# EAGLE design d11toy3 (EAGLE 6.6.0)
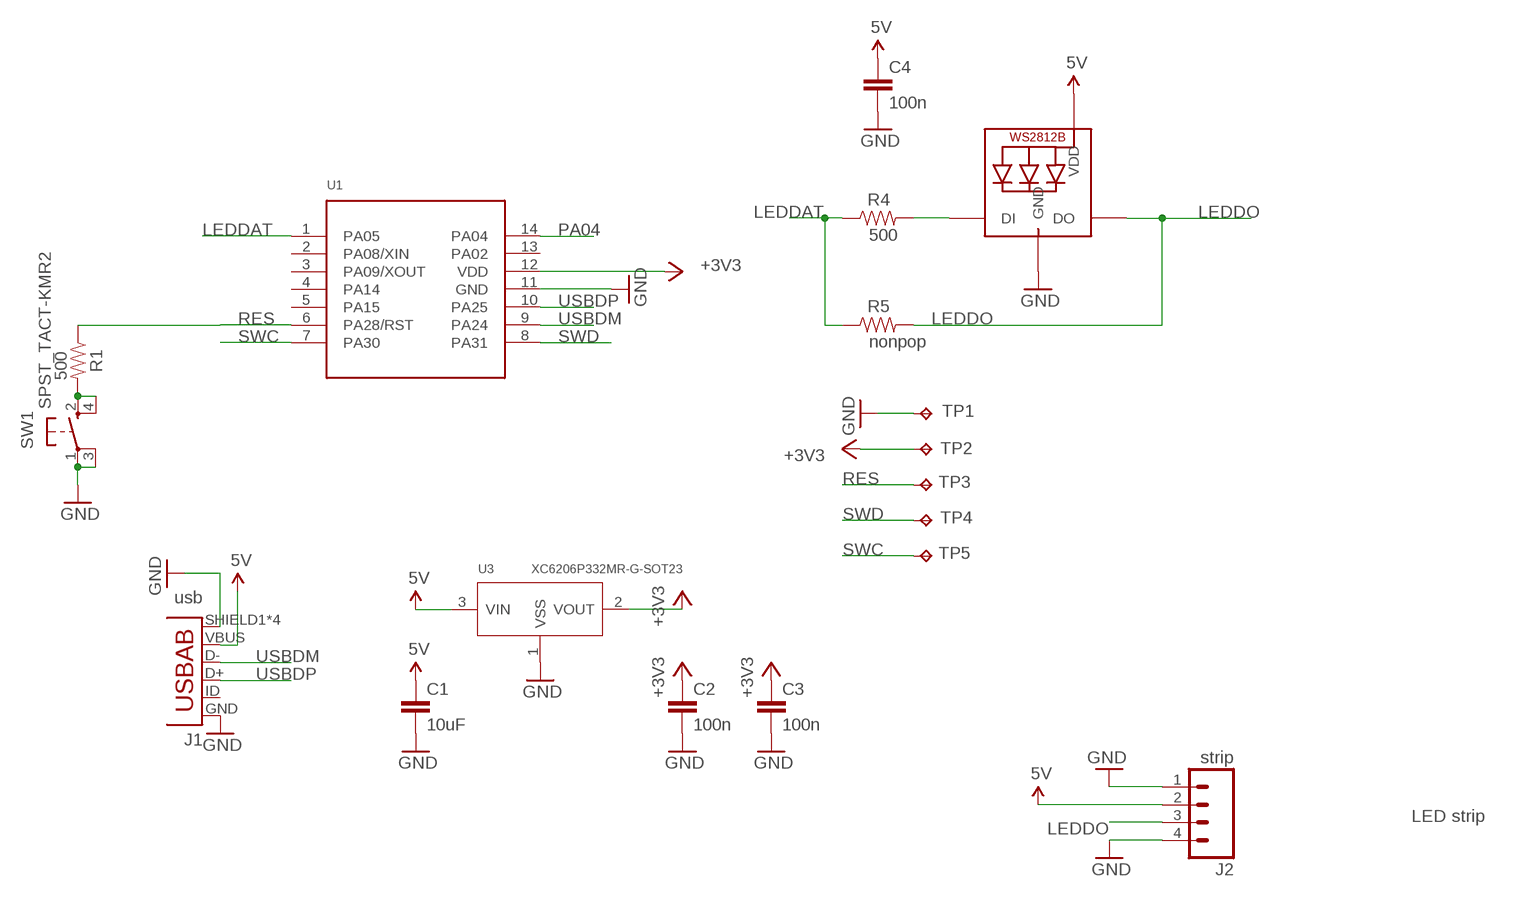
[diagram p0: schematic, sheet 1]

## Parts
C1  10uF  CAP0603-CAP  [0603-CAP]
C2  100n  CAP0603-CAP  [0603-CAP]
C3  100n  CAP0603-CAP  [0603-CAP]
C4  100n  CAP0603-CAP  [0603-CAP]
J1  usb  USB-AB  [USB-AB-MICRO-SMD]
J2  strip  M04NO_SILK_ALL_ROUND  [1X04_NO_SILK_ALL_ROUND]
LED2  WS2812B5050  [WS2812B]
R1  500  RESISTOR0603-RES  [0603-RES]
R4  500  RESISTOR0603-RES  [0603-RES]
R5  nonpop  RESISTOR0603-RES  [0603-RES]
SW1  SPST_TACT-KMR2  [KMR2]
TP1  TPB1,27  [B1,27]
TP2  TPB1,27  [B1,27]
TP3  TPB1,27  [B1,27]
TP4  TPB1,27  [B1,27]
TP5  TPB1,27  [B1,27]
U1  SAMD11C14  [SO14]
U3  XC6206P332MR-G-SOT23  PMIC-LDO-XC6206P332MR-G(SOT23)  [SOT-23]

## Nets
5V: C1.1 C4.1 J1.VBUS J2.2 LED2.1-VDD(VDD) U3.3(VIN)
+3V3: C2.1 C3.1 TP2.TP U1.12(VDD) U3.2(VOUT)
GND: C1.2 C2.2 C3.2 C4.2 J1.GND J1.SHIELD1(SHIELD) J1.SHIELD2(SHIELD) J1.SHIELD3(SHIELD) J1.SHIELD4(SHIELD) J2.1 J2.4 LED2.3-GND(GND) SW1.1(P) SW1.3(P1) TP1.TP U1.11(GND) U3.1(VSS)
LEDDAT: R4.1 R5.1 U1.1(PA05)
LEDDO: J2.3 LED2.2-DOUT(DO) R5.2
N$2: R1.2 SW1.2(S) SW1.4(S1)
N$5: LED2.4-DIN(DI) R4.2
PA04: U1.14(PA04)
RES: R1.1 TP3.TP U1.6(PA28/RST)
SWC: TP5.TP U1.7(PA30)
SWD: TP4.TP U1.8(PA31)
USBDM: J1.D- U1.9(PA24)
USBDP: J1.D+ U1.10(PA25)
Unconnected: J1.ID(USBID) U1.2(PA08/XIN) U1.3(PA09/XOUT) U1.4(PA14) U1.5(PA15) U1.13(PA02)

## Notes on the sheet
- LED strip

## Library data of the parts
C1-C4 = SparkFun-Capacitors:CAP: Capacitor Standard 0603 ceramic capacitor, and 0.1" leaded capacitor.
J1 = SparkFun-Connectors:USB-AB: This is a USB AB connector that is compatible with USB OTG. i.e. this connector can serve as a host or device
J2 = SparkFun-Connectors:M04: Header 4 Standard 4-pin 0.1" header. Use with straight break away headers (SKU : PRT-00116), right angle break away headers (PRT-00553), swiss pins (PRT-00743), machine pins (PRT-00117), and female headers (PRT-00115). Molex polarized connector foot print use with SKU : PRT-08231 with associated crimp pins and housings. 1MM SMD Version SKU: PRT-10208; PROD_ID: CONN-09696
LED2 = adafruit:WS2812B
R1 R4 R5 = SparkFun-Passives:RESISTOR: Resistor Basic schematic elements and footprints for 0603, 1206, and PTH resistors.
SW1 = adafruit:SPST_TACT: SMT 6mm switch, EVQQ2 series http://www.ladyada.net/library/eagle
TP1-TP5 = testpad:TP: Test pad
U1 = todstuff:SAMD11C14: ATSAMD11C14A-SS - SAMD11 14-pin SOIC
U3 = Seeed-IC-2016:PMIC-LDO-XC6206P332MR-G(SOT23): 310030099; MPN: XC6206P332MR-G

## Board
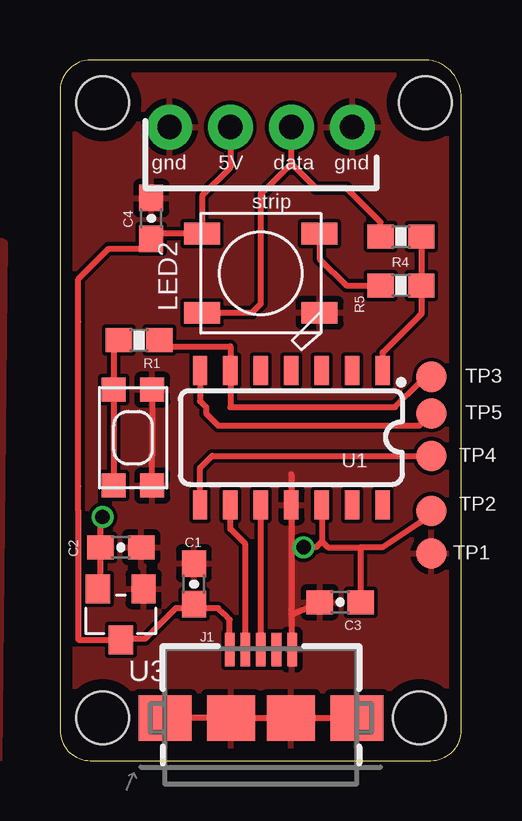
[diagram p1: board, top side]
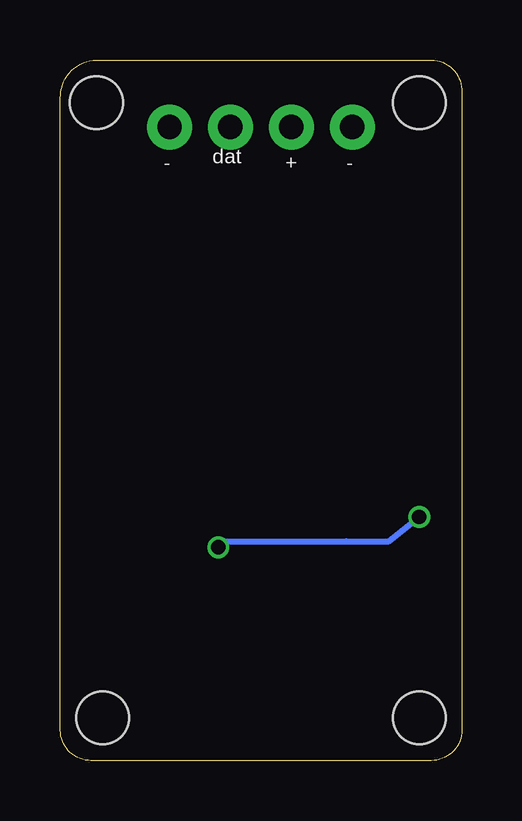
[diagram p2: board, bottom side, seen from below]

Size 16.74 x 29.21 mm. Coordinates in mm from the lower left corner, seen from the top.
Outline: 0,27.86 0,1.27 arc90 1.27,0 15.47,0 arc90 16.74,1.27 16.74,27.61 arc90 15.24,29.21 1.27,29.21 arc90 0,27.86
Copper layers (1*16): Top 0.035mm / dielectric 1.6mm / Bottom 0.035mm
Design rules "Elecrow_2-layer_PCB_eagle_rule": minimum track width 6mil, minimum drill 12mil, track to track 6mil, track to pad 6mil, pad to pad 6mil, via to via 8mil, smd to smd 0mil, copper to edge 20mil, drill to drill 10mil, minimum pad ring 6mil, minimum via ring 6mil, stop-mask expansion 0mil, vias tented up to drill 100mil, thermal gap 10mil
Holes 2.2 mm at 14.99,1.78 15.24,27.43 1.78,1.78 1.78,27.43

### Footprints (pad centres in the part's own frame; a part is rotated, then mirrored left to right if it is on the bottom)
0603-CAP = smd 1.1 x 1: 1 -0.85,0; 2 0.85,0
USB-AB-MICRO-SMD = smd 1.4 x 0.4: D+ 2.85,0; D- 2.85,0.65; GND 2.85,-1.3; ID 2.85,-0.65; VBUS 2.85,1.3 | smd 1.9 x 2.2: SHIELD1 0,4; SHIELD4 0,-4 | smd 1.9 x 2: SHIELD2 0,1.25; SHIELD3 0,-1.25
1X04_NO_SILK_ALL_ROUND = drill 1.016 pad 1.88: 1 0,0; 2 2.54,0; 3 5.08,0; 4 7.62,0
WS2812B = smd 1.5 x 0.9: 1-VDD 2.45,-1.65; 2-DOUT 2.45,1.65; 3-GND -2.45,1.65; 4-DIN -2.45,-1.65
0603-RES = smd 1.1 x 1: 1 -0.85,0; 2 0.85,0
KMR2 = smd 1 x 1: 1 2,0.8; 2 2,-0.8; 3 -2,0.8; 4 -2,-0.8
B1,27 = smd 1.27 x 1.27: TP 0,0
SO14 = smd 0.6 x 1.2: 1 -3.81,-2.8; 2 -2.54,-2.8; 3 -1.27,-2.8; 4 0,-2.8; 5 1.27,-2.8; 6 2.54,-2.8; 7 3.81,-2.8; 8 3.81,2.8; 9 2.54,2.8; 10 1.27,2.8; 11 0,2.8; 12 -1.27,2.8; 13 -2.54,2.8; 14 -3.81,2.8
SOT-23 = smd 1.016 x 1.2: 1 -0.95,-1.06; 2 0.95,-1.06; 3 0,1.06

### Placement (x,y rotation side)
C1  5.59,7.37 90 top
C2  2.54,8.89 0 top
C3  11.68,6.6 180 top
C4  3.81,22.61 90 top
J1  8.38,1.78 90 top
J2  4.57,26.42 0 top
LED2  8.38,20.32 180 top
R1  3.3,17.53 180 top
R4  14.22,19.81 180 top
R5  14.22,21.84 180 top
SW1  3.05,13.46 270 top
TP1  15.49,8.64 0 top
TP2  15.49,10.41 0 top
TP3  15.49,16 0 top
TP4  15.49,12.7 0 top
TP5  15.49,14.48 0 top
U1  9.65,13.46 180 top
U3  2.54,6.1 180 top

### Tracks (layer width: path | path; a pad name or v marks a point on that pad's centre or on a via)
5V
  Top 0.254: J1.VBUS 7.08,5.87 6.86,6.1 6.6,6.35 5.59,6.35 | J2.2 7.11,24.73 5.93,23.55 LED2.1-VDD 3.81,21.97 C4.1 3.72,21.34 2.03,21.34 0.76,20.07 0.76,18.29 0.76,11.43 0.76,10.41 0.76,5.04 U3.3 2.58,5.08 3.56,5.08 4.83,6.35 5.59,6.35 | 5.59,6.35 C1.1
  pour Top: -3.81,22.35 -4.06,18.8 -3.81,0 -2.54,0 -2.29,21.59
+3V3  (via drill 0.6)
  Top 0.254: U1.12 10.92,9.14 | 10.92,9.14 11.18,8.89 12.53,8.89 | 12.53,8.89 C3.1 | TP2.TP 15.24,10.16 14.99,9.91 13.46,8.89 13.3,8.89 12.53,8.89 | U3.2 1.69,7.16 C2.1 1.69,9.82 1.78,9.91 v1.78,10.16 | 10.92,9.14 10.67,8.89 v10.16,8.89
  Bottom 0.254: v10.16,8.89 9.91,9.14 4.83,9.14 3.05,9.14 v1.78,10.16
GND
  Top 0.254: J1.SHIELD4 J1.SHIELD3 J1.SHIELD2 J1.SHIELD1 | 9.65,6.35 U1.11 9.65,11.94 | 9.65,6.35 9.65,6.1 C3.2 | SW1.1 3.85,12.74 | 3.85,12.74 3.81,12.7 | SW1.3 3.85,12.74 | TP1.TP 15.24,8.89 | J1.GND 9.68,6.07 9.65,6.35
  pour Top: 22.61,28.96 -1.27,28.96 -1.27,0 24.13,0 24.13,17.78
LEDDAT
  Top 0.254: U1.1 13.46,17.02 14.99,18.54 15.07,18.63 R4.1 R5.1
LEDDO
  Top 0.254: 9.65,24.89 J2.3 | R5.2 13.37,22.44 11.94,23.88 10.67,23.88 9.65,24.89 | LED2.2-DOUT 8,18.67 8.38,19.05 8.38,23.62 9.65,24.89
N$2
  Top 0.254: SW1.2 SW1.4 2.25,17.32 R1.2
N$5
  Top 0.254: LED2.4-DIN 10.83,20.92 11.94,19.81 R4.2
RES
  Top 0.254: R1.1 4.23,17.18 4.32,17.27 7.11,17.27 U1.6 | U1.6 7.11,16 U1.6 | U1.6 7.11,14.73 13.21,14.73 13.97,14.73 14.99,15.75 15.24,15.75 TP3.TP
SWC
  Top 0.254: U1.7 5.84,14.99 6.1,14.73 6.1,14.48 6.6,13.97 14.99,13.97 TP5.TP
SWD
  Top 0.254: U1.8 5.84,12.19 6.35,12.7 TP4.TP
USBDM
  Top 0.254: 7.62,4.77 J1.D- 7.73,8.78 7.73,9.03 7.11,9.65 U1.9
USBDP
  Top 0.254: J1.D+ U1.10

### Text on the board
tPlace: gnd | 5V | data | gnd | strip | BlinkM Neo | blinkm.thingm.com
bPlace: - | + | dat | - | 5V | 5V | A1 | A0 | blinkm_mk2v5c | gnd | gnd